# Altium project JH_Connector_Board.PrjPcb
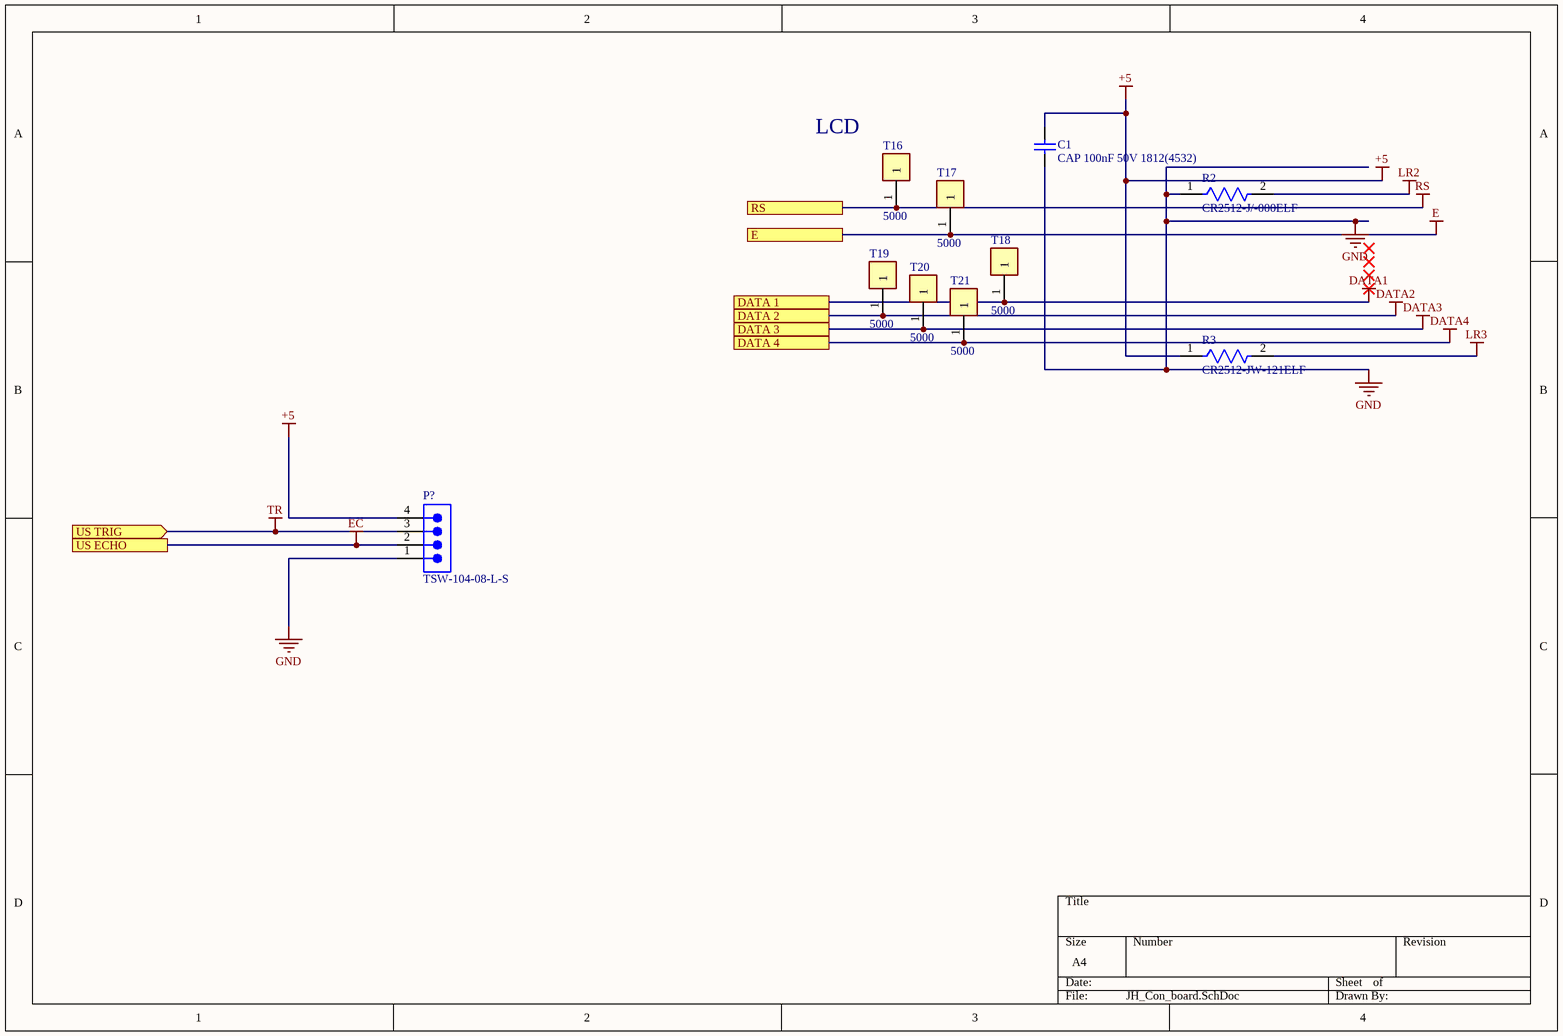
[diagram p0: JH_Con_board.SchDoc]
3 sheets, 51 parts. Net scope: flat (ports and power ports of the same name join across sheets).
Board file: JH_Con_board.PcbDoc
Sheets:
  JH_Con_board.SchDoc
  JH_Con_board2.SchDoc
  JH_Con_board3.SchDoc

## Sheet JH_Con_board.SchDoc
size A4; SheetNumber: 1; SheetTotal: 3

### Parts
(Parts that share a designator on the sheet are numbered #1, #2 ... from top to bottom, then left to right.)
C1  CAP 100nF 50V 1812(4532)  [CAPC1812(4532)100_M]
P3#1  TSW-104-08-L-S  [SMTC-TSW-104-08-X-S]
R2  CR2512-J/-000ELF  [FP-CR2512-IPC_C]
R3  CR2512-JW-121ELF  [FP-CR2512-IPC_C]
T16  5000  [FP-5000-MFG]
T17  5000  [FP-5000-MFG]
T18  5000  [FP-5000-MFG]
T19  5000  [FP-5000-MFG]
T20  5000  [FP-5000-MFG]
T21  5000  [FP-5000-MFG]

### Ports
DATA 1, DATA 2, DATA 3, DATA 4, E, RS, US ECHO, US TRIG (in)

### Nets
+5: C1.2 P3#1.4 R3.1
DATA1: T18.1 ; port DATA 1
DATA2: T19.1 ; port DATA 2
DATA3: T20.1 ; port DATA 3
DATA4: T21.1 ; port DATA 4
E: T17.1 ; port E
EC: P3#1.2 ; port US ECHO
GND: C1.1 P3#1.1 R2.1
LR2: R2.2
LR3: R3.2
RS: T16.1 ; port RS
TR: P3#1.3 ; port US TRIG

### Notes on the sheet
- LCD

### Library data of the parts
C1 = CMP-1040-01293-1: CAP 100nF 50V ±20% 1812 (4532 Metric) Thickness 1mm SMD; Case-Metric: 4532; Tolerance: Â±20%; Case-EIA: 1812; Rated Voltage: 50 V; Value: 100nF; Max Thickness: 1 mm; Technology: SMT
P3#1 = CMP-1024-00358-1: 0.025" SQ Post Header, Through-hole, Vertical, -55 to 125 degC, 2.54 mm Pitch, 4-Pin, Male, RoHS; Manufacturer: Samtec; Pitch: 2.54 mm; PartNumber: TSW-104-08-L-S; RoHS: True; Temperature Range: -55 to 125 degC; PackageDescription: .025[0.64] SQ. Post Terminal Strip Assembly; Orientation: Vertical; ComponentLink2URL: http://www.samtec.com/documents/webfiles/pdf/TSW_TH.PDF; ComponentLink1Description: Manufacturer URL; ComponentLink2Description: Datasheet; PackageVersion: DM, 8/1988; ComponentLink3URL: http://www.samtec.com/documents/webfiles/cpdf/TSW-XXX-XX-XXX-X-XX-XXX-MKT.pdf; Mounting Technology: Through-hole; PackageReference: TSW-104-08-X-S; ComponentLink3Description: Package Specification; ComponentLink1URL: http://www.samtec.com; DatasheetVersion: F-214
R2 = CMP-07231-001301-1: Thick Film Chip Resistors 2512 0Ω 1W 5%; Resistance: 0mR; Voltage Rating: 200V; Temperature Coefficient: 500ppm/°C; Max Operating Temperature: 155°C; Depth: 3.1mm; Case Code (Metric): 6332; REACH SVHC: No SVHC; Packaging: Tape and Reel; Min Operating Temperature: -55°C; Case Code (Imperial): 2512; Power Rating: 1W; Composition: Thick Film; Radiation Hardening: No; Contact Plating: Tin; Military Standard: Not; Termination: SMD/SMT; Max Power Dissipation: 1W; Tolerance: 5%; Mount: Surface Mount; Case/Package: 2512; Voltage Rating (DC): 200V; Length: 6.3mm
R3 = CMP-07231-004395-1: Thick Film Chip Resistors 2512 120Ω 1W 5% 200ppm/°C; Resistance: 120R; Max Power Dissipation: 1W; Height: 0.03inch; Case/Package: 2512; Tolerance: 5%; Max Operating Temperature: 155°C; Depth: 3.1mm; Mount: Surface Mount; Number of Terminations: 2; Packaging: Tape and Reel; Package Quantity: 4000; Min Operating Temperature: -55°C; Temperature Coefficient: 200ppm/°C; Composition: Thick Film; Length: 0.248inch; Power Rating: 1W; Width: 0.122inch; Military Standard: Not
T16-T21 = CMP-19636-000027-1: PC TEST POINT MINIATURE RED; Outside Diameter: 2.54mm; Body Material: Bronze; Number of Contacts: 1; Insulation: Insulated; Inside Diameter: 1.27mm; Hole Diameter: 1.6mm; Plating: Silver; Material: Nylon; Length: 7.62mm; Package Quantity: 100; Number of Ports: 1; Contact Material: Bronze; Orientation: Straight; RoHS Compliant: Yes; Housing Color: Red; Height: 0.3inch; Series: THM; Lead Free: Lead Free; Color: Red; Contact Plating: Tin; Mount: PCB; Packaging: Bulk; REACH SVHC: No SVHC; Flammability Rating: UL94 V-0

## Sheet JH_Con_board2.SchDoc
size A4; SheetNumber: 2; SheetTotal: 3
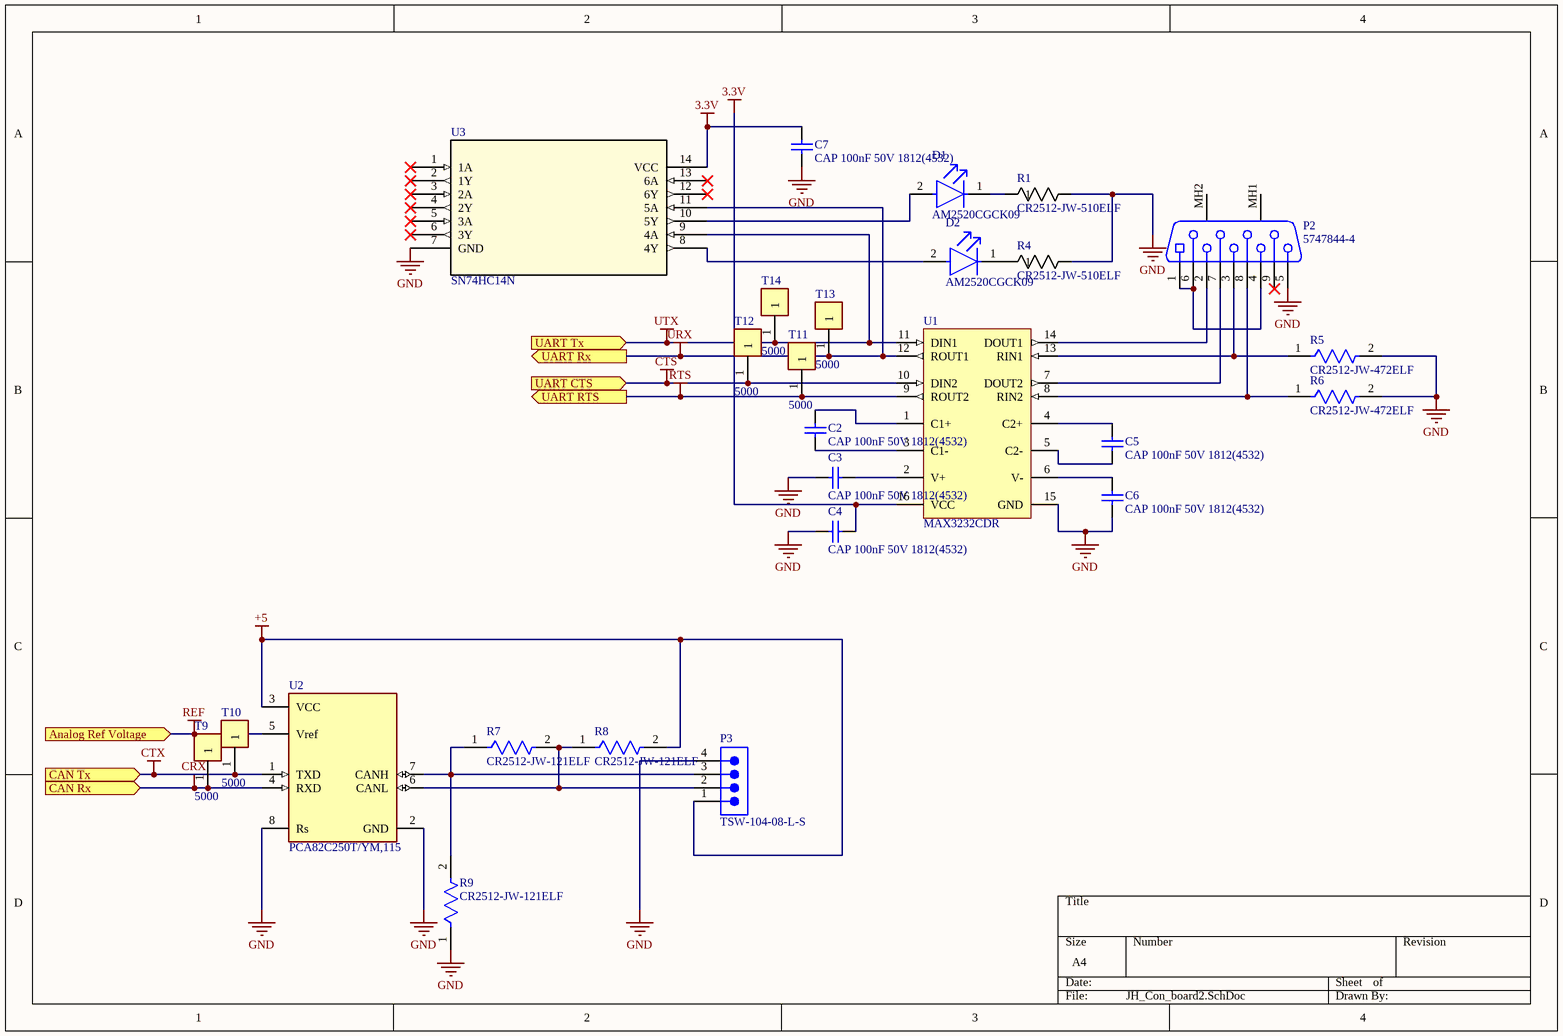
[diagram p1: JH_Con_board2.SchDoc]

### Parts
(Parts that share a designator on the sheet are numbered #1, #2 ... from top to bottom, then left to right.)
C2  CAP 100nF 50V 1812(4532)  [CAPC1812(4532)100_M]
C3  CAP 100nF 50V 1812(4532)  [CAPC1812(4532)100_M]
C4  CAP 100nF 50V 1812(4532)  [CAPC1812(4532)100_M]
C5  CAP 100nF 50V 1812(4532)  [CAPC1812(4532)100_M]
C6  CAP 100nF 50V 1812(4532)  [CAPC1812(4532)100_M]
C7  CAP 100nF 50V 1812(4532)  [CAPC1812(4532)100_M]
D1  AM2520CGCK09  [FP-AM2520CGCK09-MFG]
D2  AM2520CGCK09  [FP-AM2520CGCK09-MFG]
P2  5747844-4  [TE-5747844-4_V]
P3#2  TSW-104-08-L-S  [SMTC-TSW-104-08-X-S]
R1  CR2512-JW-510ELF  [RES_CR2512_BRN]
R4  CR2512-JW-510ELF  [RES_CR2512_BRN]
R5  CR2512-JW-472ELF  [FP-CR2512-IPC_A]
R6  CR2512-JW-472ELF  [FP-CR2512-IPC_A]
R7  CR2512-JW-121ELF  [FP-CR2512-IPC_C]
R8  CR2512-JW-121ELF  [FP-CR2512-IPC_C]
R9  CR2512-JW-121ELF  [FP-CR2512-IPC_C]
T9  5000  [FP-5000-MFG]
T10  5000  [FP-5000-MFG]
T11  5000  [FP-5000-MFG]
T12  5000  [FP-5000-MFG]
T13  5000  [FP-5000-MFG]
T14  5000  [FP-5000-MFG]
U1  MAX3232CDR  [D0016A_L]
U2  PCA82C250T/YM,115  [FP-PCA82C250T-YM_115-MFG]
U3  SN74HC14N  [N14]

### Ports
Analog Ref Voltage (in), CAN Rx (in), CAN Tx (in), UART CTS (in), UART RTS (out), UART Rx (out), UART Tx (in)

### Nets
3.3V: C4.2 C7.2 U1.16(VCC) U3.14(VCC)
+5: P3#2.1 R8.2 U2.3(VCC)
CRX: T9.1 U2.4(RXD) ; port CAN Rx
CTS: T12.1 U1.10(DIN2) ; port UART CTS
CTX: T10.1 U2.1(TXD) ; port CAN Tx
GND: C3.1 C4.1 C6.1 C7.1 P2.5 P3#2.4 R1.2 R4.2 R5.2 R6.2 R9.1 U1.15(GND) U2.2(GND) U2.8(Rs) U3.7(GND)
REF: U2.5(Vref) ; port Analog Ref Voltage
RTS: T11.1 U1.9(ROUT2) ; port UART RTS
URX: T13.1 U1.12(ROUT1) U3.11(5A) ; port UART Rx
UTX: T14.1 U1.11(DIN1) U3.9(4A) ; port UART Tx
NetC2_1: C2.1 U1.3(C1-)
NetC2_2: C2.2 U1.1(C1+)
NetC3_2: C3.2 U1.2(V+)
NetC5_1: C5.1 U1.5(C2-)
NetC5_2: C5.2 U1.4(C2+)
NetC6_2: C6.2 U1.6(V-)
NetD1_1: D1.1(C) R1.1
NetD1_2: D1.2(A) U3.10(5Y)
NetD2_1: D2.1(C) R4.1
NetD2_2: D2.2(A) U3.8(4Y)
NetP2_1: P2.1 P2.4 P2.6
NetP2_2: P2.2 U1.14(DOUT1)
NetP2_3: P2.3 R5.1 U1.13(RIN1)
NetP2_7: P2.7 U1.7(DOUT2)
NetP2_8: P2.8 R6.1 U1.8(RIN2)
NetP3#2_2: P3#2.2 R7.2 R8.1 U2.6(CANL)
NetP3#2_3: P3#2.3 R7.1 R9.2 U2.7(CANH)

Not connected (* = marked no-connect by the designer): P2 9* MH1 MH2; U3 1(1A)* 2(1Y)* 3(2A)* 4(2Y)* 5(3A)* 6(3Y)* 12(6Y)* 13(6A)*

### Library data of the parts
C2-C7 = CMP-1040-01293-1: as C1 on sheet JH_Con_board; Rated Voltage: 50 V; Value: 100nF; Max Thickness: 1 mm; Technology: SMT
D1 D2 = CMP-44529-000013-1: LED GREEN CLEAR SMD; Manufacturer: Kingbright; Reverse Voltage: 5V; Led Orientation: Top View; Max Junction Temp: +115°C; Power Dissipation: 75mW; Peak Emmision Wavelength: 574nm; Wavelength: 570nm; Forward Voltage: 2.1V; Forward Current: 20mA; Viewing Angle: 20°; Luminous Intensity: 1000mcd; ComponentLink2Description: Datasheet; Mouser Description: Standard LEDs - SMD Green Water Clear 570nm 400mcd; Temperature: -40°C to +85°C; Category: Diode; Device Class L2: LEDs; Digikey Description: LED GREEN CLEAR SMD; Automotive: No; Device Class L3: unset; Colour: Green; Height: 1.7mm; Temperature Range High: +85°C; Package: AM2520CGCK09; Octopart: https://octopart.com/am2520cgck09-kingbright-5355462; Temperature Range Low: -40°C; ComponentLink2URL: http://www.kingbrightusa.com/images/catalog/SPEC/AM2520CGCK09.pdf; Device Class L1: Optoelectronics; Manufacturer Part Number: AM2520CGCK09; Lead Free: Yes; RoHS: TRUE
P2 = CMP-1684-00001-6: Female D-Sub Receptacle, Pitch 1.3716 mm, 9 Position, Height 12.9286 mm, -55 to 105 degC, RoHS, Tray; Manufacturer: TE Connectivity; Voltage Rating: 125 V; Current Rating: 6 A; Rows: 2; Mounting Technology: Through Hole; Height: 12.54 mm; Lead Pitch: 2.74 mm; ComponentLink1Description: Manufacturer URL; DatasheetVersion: Rev. P, 03/2011; ComponentLink2Description: Datasheet; REACH SVHC: No SVHC; Max Operating Temperature: 105 degC; Contact Material: Bronze; Mount: Through Hole; Contact Plating: Gold; Colour: Black; ComponentLink1URL: http://www.te.com/; RoHSCompliant: true; Min Operating Temperature: -55 degC; PackageReference: 5747844-4; Contact Finish: Gold; Packaging: Tray; Pins: 9; Length: 30.81 mm; Package Quantity: 130; PackageDescription: Female D-Sub Receptacle, Pitch 1.3716 mm, 9 Position, Height 12.9286 mm; ComponentLink2URL: http://www.te.com/commerce/DocumentDelivery/DDEController?Action=srchrtrv&DocNm=5747844&DocType=Customer+Drawing&DocLang=English
P3#2 = CMP-1024-00358-1: as P3#1 on sheet JH_Con_board; PartNumber: TSW-104-08-L-S; RoHS: True; Temperature Range: -55 to 125 degC; PackageDescription: .025[0.64] SQ. Post Terminal Strip Assembly; Orientation: Vertical; ComponentLink2URL: http://www.samtec.com/documents/webfiles/pdf/TSW_TH.PDF; ComponentLink1Description: Manufacturer URL; ComponentLink2Description: Datasheet; PackageVersion: DM, 8/1988; ComponentLink3URL: http://www.samtec.com/documents/webfiles/cpdf/TSW-XXX-XX-XXX-X-XX-XXX-MKT.pdf; Mounting Technology: Through-hole; PackageReference: TSW-104-08-X-S; ComponentLink3Description: Package Specification; ComponentLink1URL: http://www.samtec.com; DatasheetVersion: F-214
R1 R4 = CR2512-JW-510ELF: No Description Available; Mfr_Name: Bourns Electronics; Copyright: Copyright (C) 2023 Ultra Librarian. All rights reserved.; Manufacturer_Part_Number: CR2512-JW-510ELF; RefDes: RefDes; Type: DEV
R5 R6 = CMP-1018-00090-2: Thick Film Chip Resistors 2512 4.7kΩ 1W 5% 200ppm/°C; Resistance: 4.7kR; Voltage Rating: 200V; RoHS Compliant: Yes; Max Power Dissipation: 1W; Number of Terminations: 2; Length: 0.248inch; Termination: SMD/SMT; Case/Package: 2512; Max Operating Temperature: 155°C; Series: CR2512; Package Quantity: 4000; Tolerance: 5%; Power Rating: 1W; Case Code (Metric): 6332; Temperature Coefficient: 200ppm/°C; Height: 0.03inch; Case Code (Imperial): 2512; Width: 0.122inch; Packaging: Tape and Reel; Resistor Type: Thick Film; Mount: Surface Mount; Min Operating Temperature: -55°C
R7-R9 = CMP-07231-004395-1: as R3 on sheet JH_Con_board; Max Power Dissipation: 1W; Height: 0.03inch; Case/Package: 2512; Tolerance: 5%; Max Operating Temperature: 155°C; Depth: 3.1mm; Mount: Surface Mount; Number of Terminations: 2; Packaging: Tape and Reel; Package Quantity: 4000; Min Operating Temperature: -55°C; Temperature Coefficient: 200ppm/°C; Composition: Thick Film; Length: 0.248inch; Power Rating: 1W; Width: 0.122inch; Military Standard: Not
T9-T14 = CMP-19636-000027-1: as T16 on sheet JH_Con_board; Length: 7.62mm; Package Quantity: 100; Number of Ports: 1; Contact Material: Bronze; Orientation: Straight; RoHS Compliant: Yes; Housing Color: Red; Height: 0.3inch; Series: THM; Lead Free: Lead Free; Color: Red; Contact Plating: Tin; Mount: PCB; Packaging: Bulk; REACH SVHC: No SVHC; Flammability Rating: UL94 V-0
U1 = CMP-0299-00399-2: 3-V to 5.5-V Multichannel RS-232 Line Driver / Receiver with ±15-kV ESD Protection, 0 to 70 degC, 16-Pin SOIC (D), Green (RoHS & no Sb/Br); Receivers Per Package: 2; ESD HBM(kV): +/-15; ICC(Max)(mA): 1; Supply Voltage(s)(V): 3.3 or 5.0; Single Supply: TRUE; ComponentLink1URL: www.ti.com; ComponentLink3URL: http://www.ti.com/litv/pdf/mpds178g; PackageReference: D0016A; ComponentLink2Description: Datasheet; ComponentLink2URL: http://www.ti.com/general/docs/lit/getliterature.tsp?genericPartNumber=MAX3232&fileType=pdf; ComponentLink1Description: Manufacturer URL; PackageDescription: 16-Pin Plastic Small Outline Integrated Circuit, 9.9 x 3.9 mm, Pitch 1.27 mm Pitch; PackageVersion: revM, Jun-2011; Drivers Per Package: 2; SubFamily: RS-232; DatasheetVersion: SLLS410I; ComponentLink3Description: Package Specification; RS-232: TRUE
U2 = CMP-10098-000006-1: IC TRANSCEIVER HALF 1/1 8SO; Manufacturer: NXP Semiconductors; Interface: CAN; Min Supply Voltage: 4.5V; Nominal Supply Current: 14-70mA; Max Supply Voltage: 5.5V; Standoff Height: 0.1mm; Max Junction Temp: +150°C; ComponentLink2URL: https://www.nxp.com/docs/en/data-sheet/PCA82C250.pdf; Temperature Range High: +150°C; Mouser Description: CAN Interface IC CAN CONTROLLER INTERFACE; Ipc Land Pattern Name: SOIC127P600X175-8; Device Class L3: unset; Octopart: https://octopart.com/pca82c250t%2Fym%2C115-nxp+semiconductors-18837169; Lead Free: Yes; ComponentLink2Description: Datasheet; Device Class L1: Integrated Circuits (ICs); Ambient Temperature Range High: +125°C; Package: SOIC8; Digikey Description: IC TRANSCEIVER HALF 1/1 8SO; RoHS: TRUE; Automotive: No; Temperature Range Low: -40°C; Manufacturer Part Number: PCA82C250T/YM,115; Device Class L2: Interface ICs; Ambient Temperature Range Low: -40°C; Temperature: -40°C to +150°C; Category: IC; Footprint Url: https://www.nxp.com/docs/en/package-information/SOT96-1.pdf; Height: 1.75mm
U3 = SN74HC14N: No Description Available; Mfr_Name: Texas Instruments; Copyright: Copyright (C) 2023 Ultra Librarian. All rights reserved.; Manufacturer_Part_Number: SN74HC14N; RefDes: RefDes; Type: DEV

## Sheet JH_Con_board3.SchDoc
size A4; SheetNumber: 3; SheetTotal: 3
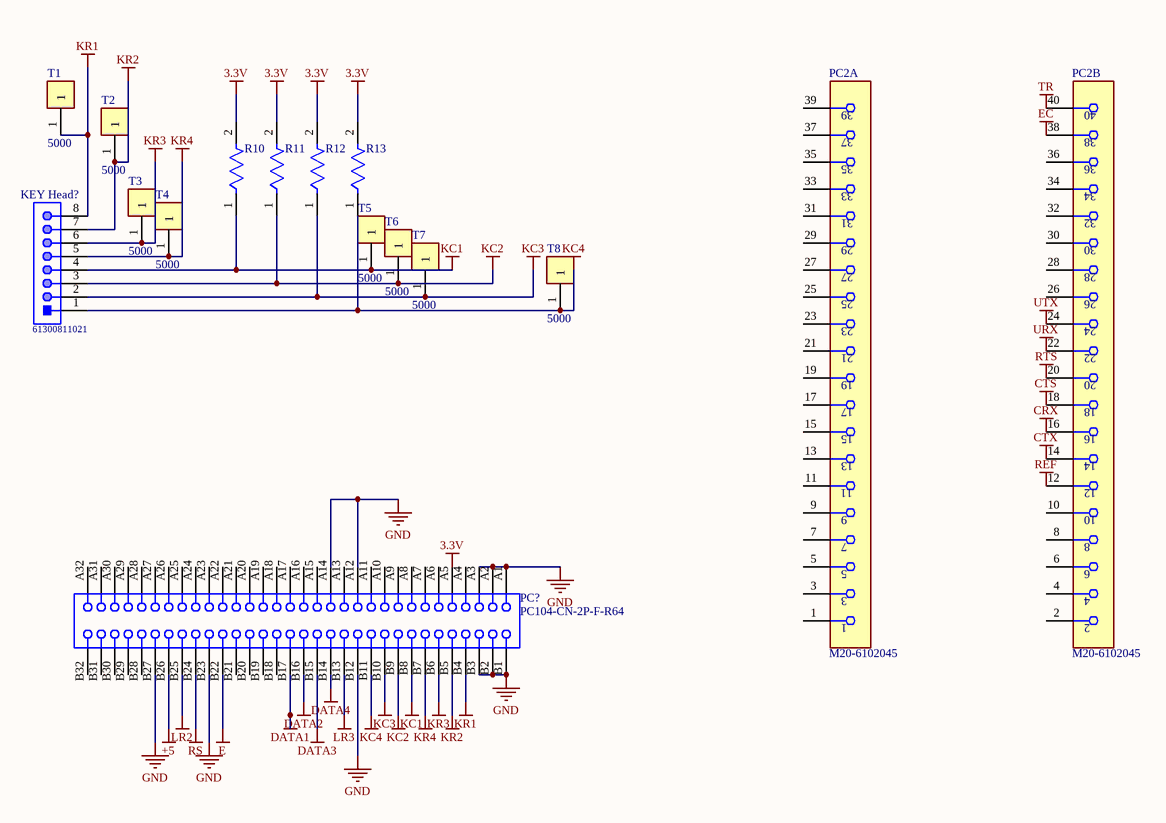
[diagram p2: JH_Con_board3.SchDoc]

### Parts
KEY_Head  61300811021  [61300811021]
PC1  PC104-CN-2P-F-R64  [BTB2-54-V64F-04]
PC2  M20-6102045  [FP-M20-6102045-MFG]  (parts A,B of 2)
R10  CR2512-JW-472ELF  [FP-CR2512-IPC_A]  (value not drawn)
R11  CR2512-JW-472ELF  [FP-CR2512-IPC_A]  (value not drawn)
R12  CR2512-JW-472ELF  [FP-CR2512-IPC_A]  (value not drawn)
R13  CR2512-JW-472ELF  [FP-CR2512-IPC_A]  (value not drawn)
T1  5000  [FP-5000-MFG]
T2  5000  [FP-5000-MFG]
T3  5000  [FP-5000-MFG]
T4  5000  [FP-5000-MFG]
T5  5000  [FP-5000-MFG]
T6  5000  [FP-5000-MFG]
T7  5000  [FP-5000-MFG]
T8  5000  [FP-5000-MFG]

### Nets
3.3V: PC1.A5 R10.2 R11.2 R12.2 R13.2
+5: PC1.B26
CRX: PC2.16
CTS: PC2.18
CTX: PC2.14
DATA1: PC1.B17
DATA2: PC1.B16
DATA3: PC1.B15
DATA4: PC1.B14
E: PC1.B22
EC: PC2.38
GND: PC1.A1 PC1.A2 PC1.A3 PC1.A12 PC1.A14 PC1.B1 PC1.B2 PC1.B3 PC1.B12 PC1.B23 PC1.B27
KC1: KEY_Head.4 PC1.B8 R10.1 T5.1
KC2: KEY_Head.3 PC1.B9 R11.1 T6.1
KC3: KEY_Head.2 PC1.B10 R12.1 T7.1
KC4: KEY_Head.1 PC1.B11 R13.1 T8.1
KR1: KEY_Head.8 PC1.B4 T1.1
KR2: KEY_Head.7 PC1.B5 T2.1
KR3: KEY_Head.6 PC1.B6 T3.1
KR4: KEY_Head.5 PC1.B7 T4.1
LR2: PC1.B25
LR3: PC1.B13
REF: PC2.12
RS: PC1.B24
RTS: PC2.20
TR: PC2.40
URX: PC2.22
UTX: PC2.24

Not connected (* = marked no-connect by the designer): PC1 A4(4) A6(6) A7(7) A8(8) A9(9) A10(10) A11(11) A13(13) A15(15) A16(16) A17(17) A18(18) A19(19) A20(20) A21(21) A22(22) A23(23) A24(24) A25(25) A26(26) A27(27) A28(28) A29(29) A30(30) A31(31) A32(32) B18(50) B19(51) B20(52) B21(53) B28(60) B29(61) B30(62) B31(63) B32(64); PC2 1 2 3 4 5 6 7 8 9 10 11 13 15 17 19 21 23 25 26 27 28 29 30 31 32 33 34 35 36 37 39

### Library data of the parts
KEY_Head = CMP-1502-01075-1: THT Angled Pin Header WR-PHD, Pitch 2.54 mm, Single Row, 8 pins; Manufacturer: Wurth Elektronik; Pin Number: 8; Rated Current: 3A; Working Voltage: 250VAC; Withstanding Voltage: 500VAC; Gender: Male; Contact Resistance: 20mOhm; Pitch: 2.54mm
PC1 = CMP-0001-00110-1: Board-to-Board Connector, PC104 BA ISA, Stackthrough, Vertical, 2-Row, 64-Postion, Pitch 2.54mm,  Receptacle, Height 11.05mm; Mating Connector: Harwin-M20-6103205 (stackthrough)
PC2 = CMP-15831-000080-1: CONN STKTHRU PC/104 40POS PCB; Current Rating: 3A; Pitch: 2.54mm; Insulation Resistance: 5GR; Contact Resistance: 30mR; Number of Positions: 40; Gender: Receptacle; REACH SVHC: No SVHC; Housing Material: Nylon; Number of Rows: 2; Min Operating Temperature: -55°C; Contact Plating: Gold; Orientation: Straight; Mount: Through Hole; Contact Material: Bronze; Length: 51.46mm; Weight: 0.218205oz; Number of Contacts: 40; Packaging: Rail/Tube; Depth: 5.25mm; Termination: Solder; Radiation Hardening: No; Flammability Rating: UL94 V-0; Housing Color: Black; Max Operating Temperature: 105°C; Material: Nylon; Package Quantity: 11; Color: Black; Max Current Rating: 3A; Series: M20
R10-R13 = CMP-1018-00090-2: as R5 on sheet JH_Con_board2; RoHS Compliant: Yes; Max Power Dissipation: 1W; Number of Terminations: 2; Length: 0.248inch; Termination: SMD/SMT; Case/Package: 2512; Max Operating Temperature: 155°C; Series: CR2512; Package Quantity: 4000; Tolerance: 5%; Power Rating: 1W; Case Code (Metric): 6332; Temperature Coefficient: 200ppm/°C; Height: 0.03inch; Case Code (Imperial): 2512; Width: 0.122inch; Packaging: Tape and Reel; Resistor Type: Thick Film; Mount: Surface Mount; Min Operating Temperature: -55°C
T1-T8 = CMP-19636-000027-1: as T16 on sheet JH_Con_board; Length: 7.62mm; Package Quantity: 100; Number of Ports: 1; Contact Material: Bronze; Orientation: Straight; RoHS Compliant: Yes; Housing Color: Red; Height: 0.3inch; Series: THM; Lead Free: Lead Free; Color: Red; Contact Plating: Tin; Mount: PCB; Packaging: Bulk; REACH SVHC: No SVHC; Flammability Rating: UL94 V-0

## Nets that join several sheets
3.3V: JH_Con_board2 (C4.2 C7.2 U1.16 U3.14), JH_Con_board3 (5 pins)
+5: JH_Con_board (C1.2 P3#1.4 R3.1), JH_Con_board2 (P3#2.1 R8.2 U2.3), JH_Con_board3 (PC1.B26)
CRX: JH_Con_board2 (T9.1 U2.4), JH_Con_board3 (PC2.16)
CTS: JH_Con_board2 (T12.1 U1.10), JH_Con_board3 (PC2.18)
CTX: JH_Con_board2 (T10.1 U2.1), JH_Con_board3 (PC2.14)
DATA1: JH_Con_board (T18.1), JH_Con_board3 (PC1.B17)
DATA2: JH_Con_board (T19.1), JH_Con_board3 (PC1.B16)
DATA3: JH_Con_board (T20.1), JH_Con_board3 (PC1.B15)
DATA4: JH_Con_board (T21.1), JH_Con_board3 (PC1.B14)
E: JH_Con_board (T17.1), JH_Con_board3 (PC1.B22)
EC: JH_Con_board (P3#1.2), JH_Con_board3 (PC2.38)
GND: JH_Con_board (C1.1 P3#1.1 R2.1), JH_Con_board2 (15 pins), JH_Con_board3 (11 pins)
LR2: JH_Con_board (R2.2), JH_Con_board3 (PC1.B25)
LR3: JH_Con_board (R3.2), JH_Con_board3 (PC1.B13)
REF: JH_Con_board2 (U2.5), JH_Con_board3 (PC2.12)
RS: JH_Con_board (T16.1), JH_Con_board3 (PC1.B24)
RTS: JH_Con_board2 (T11.1 U1.9), JH_Con_board3 (PC2.20)
TR: JH_Con_board (P3#1.3), JH_Con_board3 (PC2.40)
URX: JH_Con_board2 (T13.1 U1.12 U3.11), JH_Con_board3 (PC2.22)
UTX: JH_Con_board2 (T14.1 U1.11 U3.9), JH_Con_board3 (PC2.24)